# EAGLE design DAB+ FM Radio (EAGLE 7.6.0)
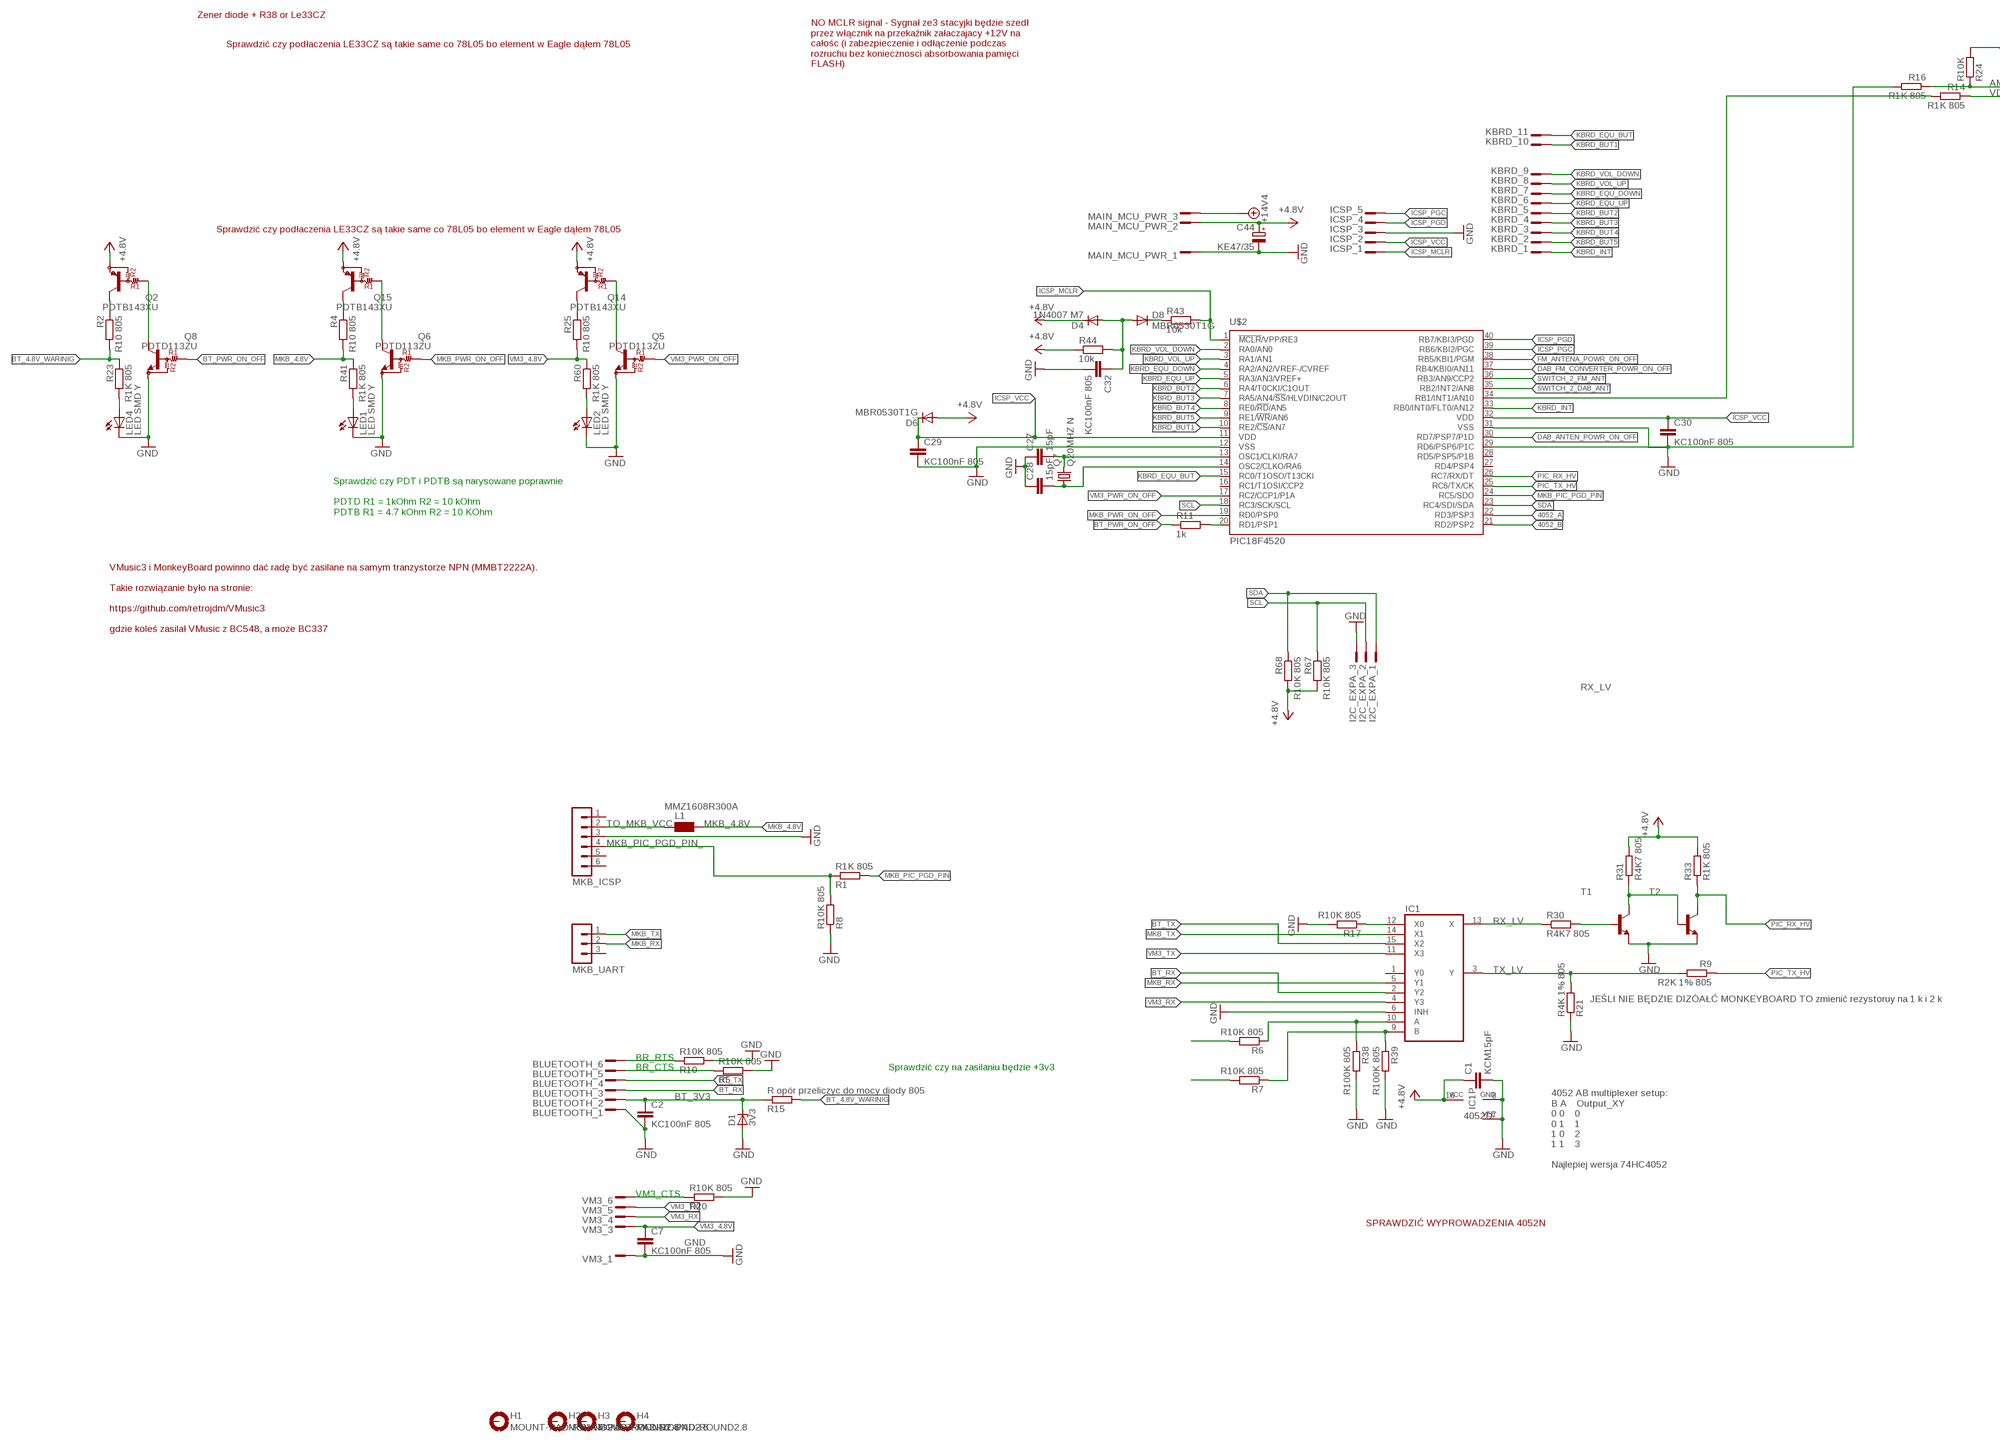
[diagram p0: schematic, sheet 1, part 1 of 2]
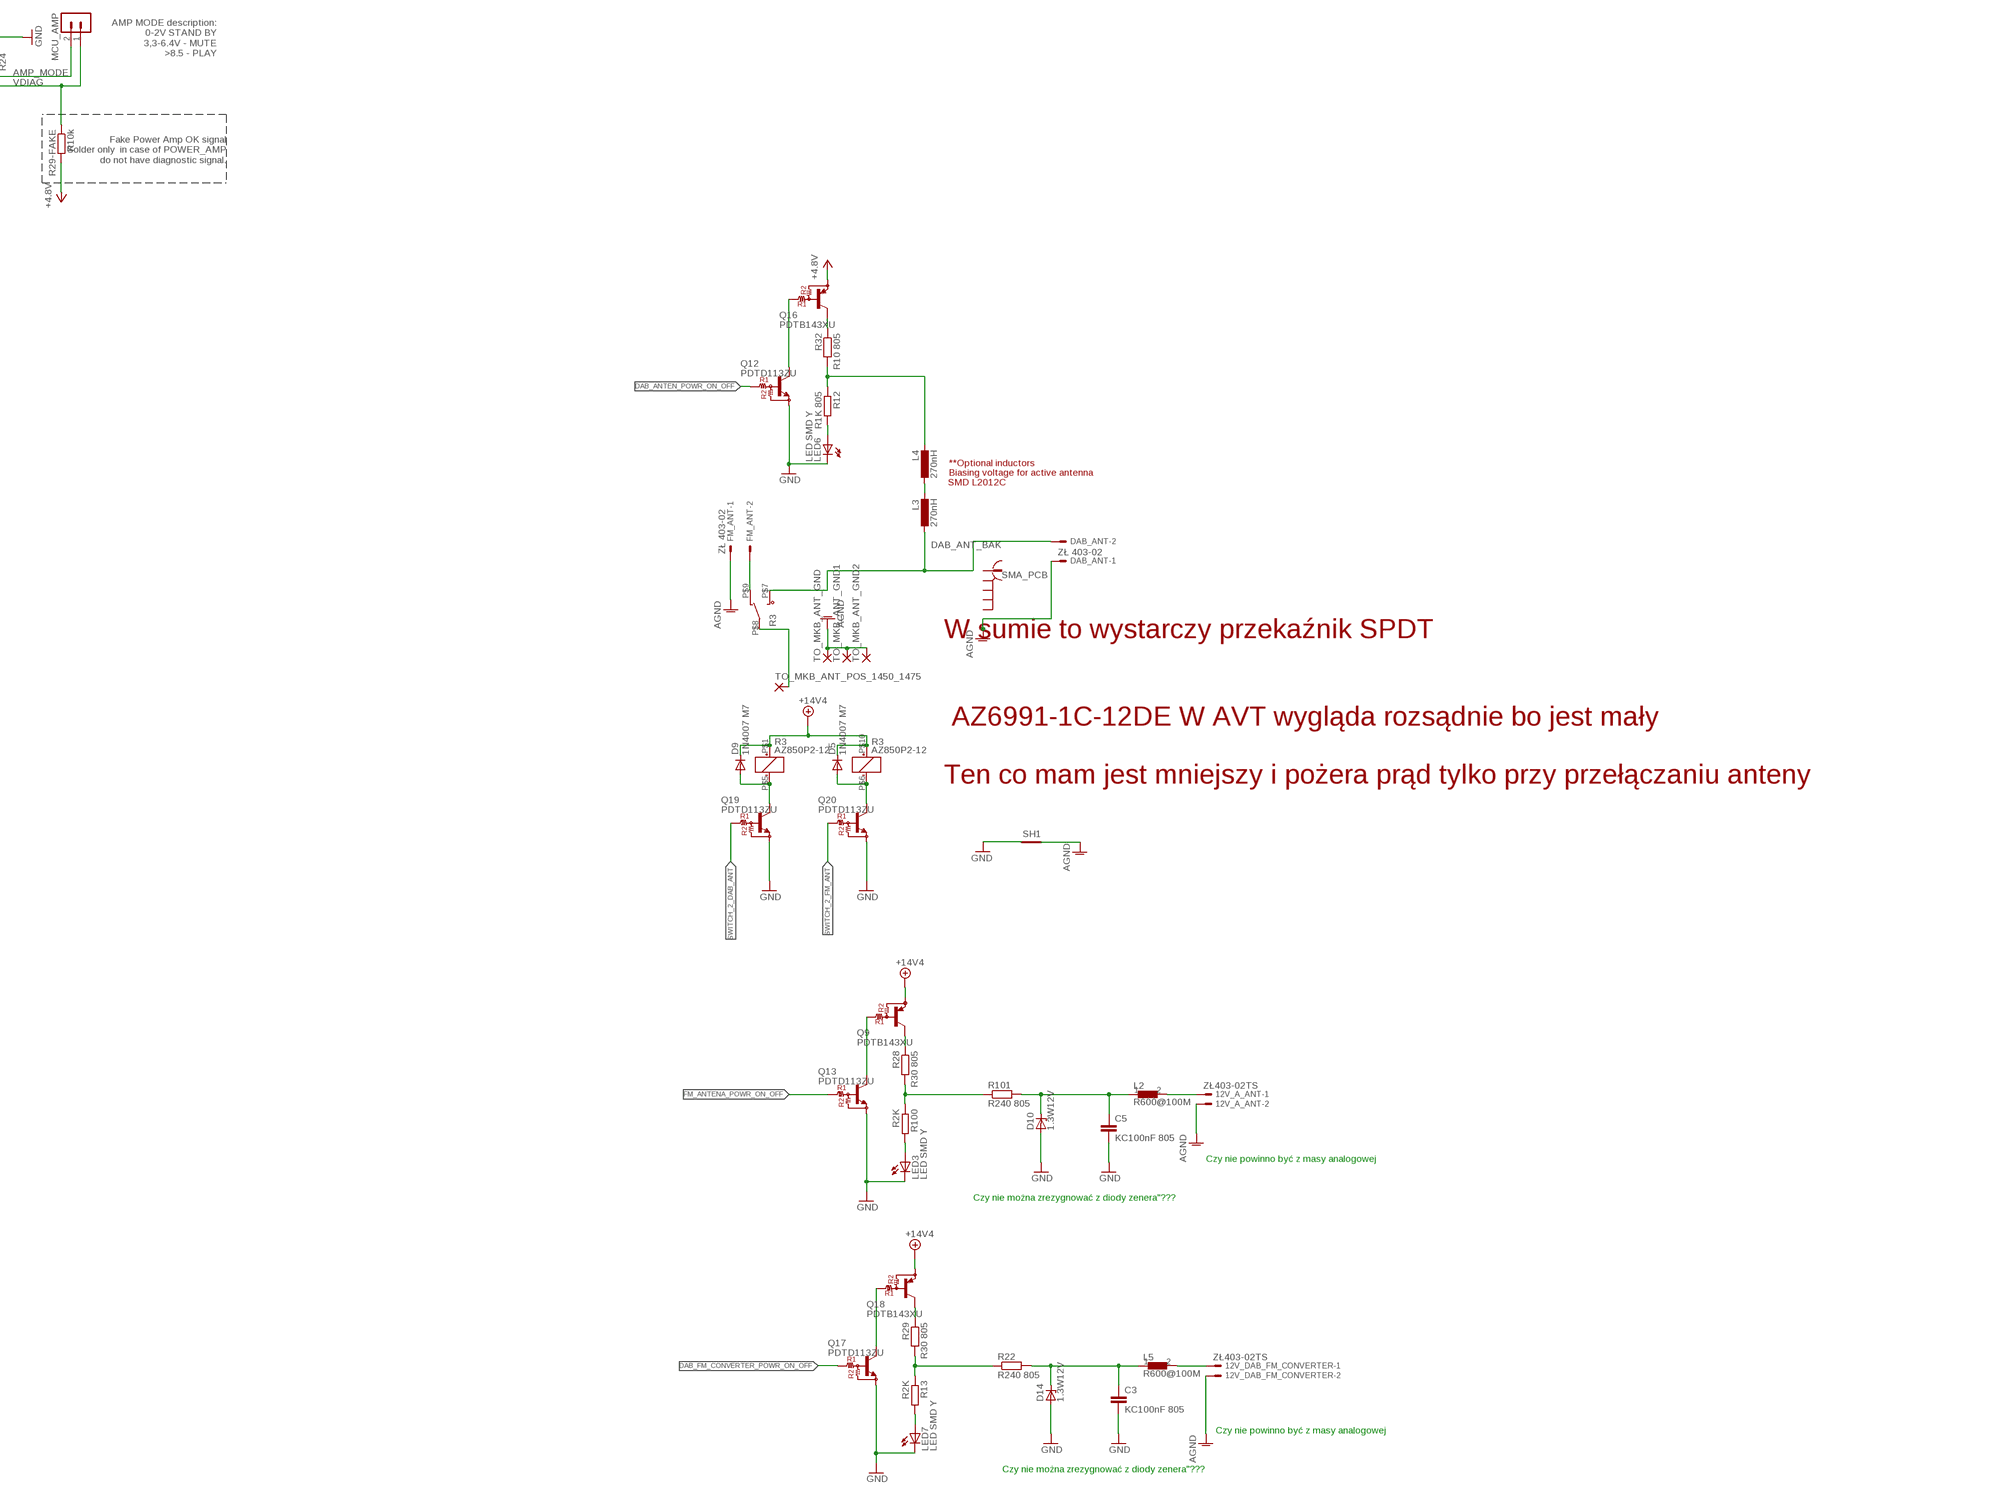
[diagram p1: schematic, sheet 1, part 2 of 2]

## Parts
12V_A_ANT  ZŁ403-02TS  22-23-2021  [22-23-2021]
12V_DAB_FM_CONVERTER  ZŁ403-02TS  22-23-2021  [22-23-2021]
BLUETOOTH  JST_6_PIN_B6B-PH-KS  [B6B-PH-KS]
C1  KCM15pF  C-EUC0805  [C0805]
C2  KC100nF 805  C-EUC0805  [C0805]
C3  KC100nF 805  C-EUC0805  [C0805]
C5  KC100nF 805  C-EUC0805  [C0805]
C7  KC100nF 805  C-EUC0805  [C0805]
C27  15pF  C-EUC0805  [C0805]
C28  15pF  C-EUC0805  [C0805]
C29  KC100nF 805  C-EUC0805  [C0805]
C30  KC100nF 805  C-EUC0805  [C0805]
C32  KC100nF 805  C-EUC0805  [C0805]
C44  KE47/35  CPOL-EUTT2D6  [TT2D6]
D1  3V3  ZENER-DIODESOD80C  [SOD80C]
D4  1N4007 M7  CGRM4001-G  [SOD-123_MINI-SMA]
D5  1N4007 M7  CGRM4001-G  [SOD-123_MINI-SMA]
D6  MBR0530T1G  MBR0520LT  [SOD123]
D8  MBR0530T1G  MBR0520LT  [SOD123]
D9  1N4007 M7  CGRM4001-G  [SOD-123_MINI-SMA]
D10  1.3W12V  ZENER-DIODEZD-2.5  [ZDIO-2.5]
D14  1.3W12V  ZENER-DIODEZD-2.5  [ZDIO-2.5]
DAB_ANT  ZŁ 403-02  22-27-2021-02  [6410-02]
DAB_ANT_BAK  SMA_PCB  [SMA_PCB]
FM_ANT  ZŁ 403-02  22-27-2021-02  [6410-02]
H1  MOUNT-PAD-ROUND2.8  [2,8-PAD]
H2  MOUNT-PAD-ROUND2.8  [2,8-PAD]
H3  MOUNT-PAD-ROUND2.8  [2,8-PAD]
H4  MOUNT-PAD-ROUND2.8  [2,8-PAD]
I2C_EXPA  JST_3_PIN_B3B-PH-KS  [B3B-PH-KS]
IC1  4052D  [SO16]
ICSP  JST_5_PIN_B5B-PH-KS  [B5B-PH-KS]
KBRD  JST_11_PIN_B11B-PH-KS  [B11B-PH-KS]
L1  MMZ1608R300A  WE-CBF_0603  [0603]
L2  R600@100M  FERRITR0805  [R0805]
L3  270nH  L-EUL2012C  [L2012C]
L4  270nH  L-EUL2012C  [L2012C]
L5  R600@100M  FERRITR0805  [R0805]
LED1  LED SMD Y  LEDCHIP-LED0805  [CHIP-LED0805]
LED2  LED SMD Y  LEDCHIP-LED0805  [CHIP-LED0805]
LED3  LED SMD Y  LED  [SMARTLED-TTW]
LED4  LED SMD Y  LEDCHIP-LED0805  [CHIP-LED0805]
LED6  LED SMD Y  LED  [SMARTLED-TTW]
LED7  LED SMD Y  LED  [SMARTLED-TTW]
MAIN_MCU_PWR  JST_3_PIN_B3B-XH-A  [B3B-XH-A]
MCU_AMP  MA02-1  [MA02-1]
MKB_ICSP  MA06-1  [MA06-1]
MKB_UART  MA03-1  [MA03-1]
Q2  PDTB143XU  [SOT-23]
Q5  PDTD113ZU  [SOT-23]
Q6  PDTD113ZU  [SOT-23]
Q7  Q20MHZ N  CRYSTALHC49S  [HC49/S]
Q8  PDTD113ZU  [SOT-23]
Q9  PDTB143XU  [SOT-23]
Q12  PDTD113ZU  [SOT-23]
Q13  PDTD113ZU  [SOT-23]
Q14  PDTB143XU  [SOT-23]
Q15  PDTB143XU  [SOT-23]
Q16  PDTB143XU  [SOT-23]
Q17  PDTD113ZU  [SOT-23]
Q18  PDTB143XU  [SOT-23]
Q19  PDTD113ZU  [SOT-23]
Q20  PDTD113ZU  [SOT-23]
R1  R1K 805  R-EU_R0805  [R0805]
R2  R10 805  R-EU_R0805  [R0805]
R3  AZ850P2-12  [AZ850-2C]
R4  R10 805  R-EU_R0805  [R0805]
R5  R10K 805  R-EU_R0805  [R0805]
R6  R10K 805  R-EU_R0805  [R0805]
R7  R10K 805  R-EU_R0805  [R0805]
R8  R10K 805  R-EU_R0805  [R0805]
R9  R2K 1% 805  R-EU_R0805  [R0805]
R10  R10K 805  R-EU_R0805  [R0805]
R11  1k  R-EU_R0805  [R0805]
R12  R1K 805  R-EU_R0805  [R0805]
R13  R2K  R-EU_R0805  [R0805]
R14  R1K 805  R-EU_R0805  [R0805]
R15  R opór przeliczyc do mocy diody 805  R-EU_R0805  [R0805]
R16  R1K 805  R-EU_R0805  [R0805]
R17  R10K 805  R-EU_R0805  [R0805]
R20  R10K 805  R-EU_R0805  [R0805]
R21  R4K 1% 805  R-EU_R0805  [R0805]
R22  R240 805  R-EU_M0805  [M0805]
R23  R1K 805  R-EU_R0805  [R0805]
R24  R10K  R-EU_R0805  [R0805]
R25  R10 805  R-EU_R0805  [R0805]
R28  R30 805  R-EU_R0805  [R0805]
R29  R30 805  R-EU_R0805  [R0805]
R29-FAKE  R10k  R-EU_M0805  [M0805]
R30  R4K7 805  R-EU_R0805  [R0805]
R31  R4K7 805  R-EU_R0805  [R0805]
R32  R10 805  R-EU_R0805  [R0805]
R33  R1K 805  R-EU_R0805  [R0805]
R38  R100K 805  R-EU_M0805  [M0805]
R39  R100K 805  R-EU_M0805  [M0805]
R41  R1K 805  R-EU_R0805  [R0805]
R43  10k  R-EU_R0805  [R0805]
R44  10k  R-EU_M0805  [M0805]
R60  R1K 805  R-EU_R0805  [R0805]
R67  R10K 805  R-EU_R0805  [R0805]
R68  R10K 805  R-EU_R0805  [R0805]
R100  R2K  R-EU_R0805  [R0805]
R101  R240 805  R-EU_M0805  [M0805]
SH1  SHORT-HT5  [SHORT_TOP-50]
T1  MMBT2222ALT1-NPN-SOT23-BEC  [SOT23-BEC]
T2  MMBT2222ALT1-NPN-SOT23-BEC  [SOT23-BEC]
TO_MKB_ANT_GND  2,54/0,8  [2,54/0,8]
TO_MKB_ANT_GND1  2,54/0,8  [2,54/0,8]
TO_MKB_ANT_GND2  2,54/0,8  [2,54/0,8]
TO_MKB_ANT_POS_1450_1475  2,54/0,8  [2,54/0,8]
U$2  PIC18F4520  [DIL40]
VM3  JST_6_PIN_B6B-PH-KS  [B6B-PH-KS]

## Nets
4052_A: R6.2 U$2.22(RD3/PSP3)
4052_B: R7.2 U$2.21(RD2/PSP2)
+5V: C1.1 C44.+ D4.C D6.A IC1.16(VCC) MAIN_MCU_PWR.P$2 Q2.2(E) Q14.2(E) Q15.2(E) Q16.2(E) R29-FAKE.2 R31.2 R33.2 R44.1 R67.2 R68.2 ; supply symbol labelled +4.8V
+14V4: D5.C D9.C MAIN_MCU_PWR.P$3 Q9.2(E) Q18.2(E) R3.P$1(S$1:+) R3.P$10(R$2:+)
AGND: 12V_A_ANT.2 12V_DAB_FM_CONVERTER.2 DAB_ANT.1 FM_ANT.1 SH1.2 TO_MKB_ANT_GND1.1(P) TO_MKB_ANT_GND2.1(P) TO_MKB_ANT_GND.1(P)
AMP_MODE: MCU_AMP.2 R16.1 R24.1
BT_3V3: BLUETOOTH.P$2 C2.1 D1.C R15.1
BT_4.8V_WARINIG: R2.2 R15.2 R23.1
BT_PWR_ON_OFF: Q8.1(B) R11.1
BT_RX: BLUETOOTH.P$3 IC1.2(Y2)
BT_TX: BLUETOOTH.P$4 IC1.15(X2)
DAB_ANTEN_POWR_ON_OFF: Q12.1(B) U$2.30(RD7/PSP7/P1D)
DAB_FM_CONVERTER_POWR_ON_OFF: Q17.1(B) U$2.37(RB4/KBI0/AN11)
FM_ANTENA_POWR_ON_OFF: Q13.1(B) U$2.38(RB5/KBI1/PGM)
GND: BLUETOOTH.P$1 C1.2 C2.2 C3.2 C5.2 C7.2 C27.1 C28.1 C29.2 C30.2 C32.2 C44.- D1.A D10.A D14.A I2C_EXPA.P$3 IC1.6(INH) IC1.7(VEE) IC1.8(GND) ICSP.P$3 LED1.C LED2.C LED3.C@1(C) LED4.C LED6.C@1(C) LED7.C@1(C) MAIN_MCU_PWR.P$1 MKB_ICSP.3 Q5.2(E) Q6.2(E) Q8.2(E) Q12.2(E) Q13.2(E) Q17.2(E) Q19.2(E) Q20.2(E) R5.2 R8.1 R10.2 R17.2 R20.2 R21.1 R24.2 R38.2 R39.2 SH1.1 T1.E T2.E U$2.12(VSS) U$2.31(VSS) VM3.P$1
ICSP_MCLR: ICSP.P$1 R43.2 U$2.1(!MCLR!/VPP/RE3)
ICSP_PGC: ICSP.P$5 U$2.39(RB6/KBI2/PGC)
ICSP_PGD: ICSP.P$4 U$2.40(RB7/KBI3/PGD)
ICSP_VCC: C29.1 C30.1 D6.C ICSP.P$2 U$2.11(VDD) U$2.32(VDD)
KBRD_BUT1: KBRD.P$10 U$2.10(RE2/!CS!/AN7)
KBRD_BUT2: KBRD.P$5 U$2.6(RA4/T0CKI/C1OUT)
KBRD_BUT3: KBRD.P$4 U$2.7(RA5/AN4/!SS!/HLVDIN/C2OUT)
KBRD_BUT4: KBRD.P$3 U$2.8(RE0/!RD!/AN5)
KBRD_BUT5: KBRD.P$2 U$2.9(RE1/!WR!/AN6)
KBRD_EQU_BUT: KBRD.P$11 U$2.15(RC0/T1OSO/T13CKI)
KBRD_EQU_DOWN: KBRD.P$7 U$2.4(RA2/AN2/VREF-/CVREF)
KBRD_EQU_UP: KBRD.P$6 U$2.5(RA3/AN3/VREF+)
KBRD_INT: KBRD.P$1 U$2.33(RB0/INT0/FLT0/AN12)
KBRD_VOL_DOWN: KBRD.P$9 U$2.2(RA0/AN0)
KBRD_VOL_UP: KBRD.P$8 U$2.3(RA1/AN1)
MKB_4.8V: L1.2 R4.2 R41.1
MKB_PIC_PGD_PIN: R1.2 U$2.24(RC5/SDO)
MKB_PIC_PGD_PIN_: MKB_ICSP.4 R1.1 R8.2
MKB_PWR_ON_OFF: Q6.1(B) U$2.19(RD0/PSP0)
MKB_RX: IC1.5(Y1) MKB_UART.2
MKB_TX: IC1.14(X1) MKB_UART.1
N$1: L4.1 R12.1 R32.2
N$2: D9.A Q19.3(C) R3.P$5(S$1:-)
N$3: R3.P$8 TO_MKB_ANT_POS_1450_1475.1(P)
N$4: DAB_ANT.2 L3.2 R3.P$7
N$5: FM_ANT.2 R3.P$9
N$6: D5.A Q20.3(C) R3.P$6(R$2:-)
N$7: Q2.3(C) R2.1
N$8: R16.2 U$2.29(RD6/PSP6/P1C)
N$9: IC1.12(X0) R17.1
N$10: R14.2 U$2.34(RB1/INT1/AN10)
N$11: R30.2 T1.B
N$12: L3.1 L4.2
N$13: IC1.9(B) R7.1 R39.1
N$14: R31.1 T1.C T2.B
N$15: C27.2 Q7.2 U$2.13(OSC1/CLKI/RA7)
N$16: C28.2 Q7.1 U$2.14(OSC2/CLKO/RA6)
N$17: R11.2 U$2.20(RD1/PSP1)
N$18: Q15.3(C) R4.1
N$19: Q2.1(B) Q8.3(C)
N$20: Q12.3(C) Q16.1(B)
N$21: LED4.A R23.2
N$23: LED6.A@1(A) R12.2
N$25: Q17.3(C) Q18.1(B)
N$26: R13.1 R22.1 R29.2
N$27: LED7.A@1(A) R13.2
N$28: Q5.3(C) Q14.1(B)
N$29: C3.1 D14.C L5.1 R22.2
N$30: 12V_DAB_FM_CONVERTER.1 L5.2
N$31: LED2.A R60.2
N$32: Q14.3(C) R25.1
N$33: Q16.3(C) R32.1
N$34: Q9.3(C) R28.1
N$35: Q18.3(C) R29.1
N$37: Q6.3(C) Q15.1(B)
N$38: BLUETOOTH.P$5 R5.1
N$39: LED1.A R41.2
N$41: D8.C R43.1
N$42: C32.1 D4.A D8.A R44.2
N$43: BLUETOOTH.P$6 R10.1
N$44: R20.1 VM3.P$6
N$47: IC1.10(A) R6.1 R38.1
N$85: Q9.1(B) Q13.3(C)
N$87: R28.2 R100.1 R101.1
N$88: LED3.A@1(A) R100.2
N$91: C5.1 D10.C L2.1 R101.2
N$92: 12V_A_ANT.1 L2.2
PIC_RX_HV: R33.1 T2.C U$2.26(RC7/RX/DT)
PIC_TX_HV: R9.1 U$2.25(RC6/TX/CK)
RX_LV: IC1.13(X) R30.1
SCL: I2C_EXPA.P$2 R67.1 U$2.18(RC3/SCK/SCL)
SDA: I2C_EXPA.P$1 R68.1 U$2.23(RC4/SDI/SDA)
SWITCH_2_DAB_ANT: Q19.1(B) U$2.35(RB2/INT2/AN8)
SWITCH_2_FM_ANT: Q20.1(B) U$2.36(RB3/AN9/CCP2)
TO_MKB_VCC: L1.1 MKB_ICSP.2
TX_LV: IC1.3(Y) R9.2 R21.2
VDIAG: MCU_AMP.1 R14.1 R29-FAKE.1
VM3_4.8V: C7.1 R25.2 R60.1 VM3.P$3
VM3_PWR_ON_OFF: Q5.1(B) U$2.17(RC2/CCP1/P1A)
VM3_RX: IC1.4(Y3) VM3.P$4
VM3_TX: IC1.11(X3) VM3.P$5
Unconnected: DAB_ANT_BAK.P$1 H1.B2,8(MOUNT) H2.B2,8(MOUNT) H3.B2,8(MOUNT) H4.B2,8(MOUNT) IC1.1(Y0) MKB_ICSP.1 MKB_ICSP.5 MKB_ICSP.6 MKB_UART.3 R3.P$2 R3.P$3 R3.P$4 U$2.16(RC1/T1OSI/CCP2) U$2.27(RD4/PSP4) U$2.28(RD5/PSP5/P1B) VM3.P$2

## Notes on the sheet
- Zener diode + R38 or Le33CZ
- Sprawdzić czy podłaczenia LE33CZ są takie same co 78L05 bo element w Eagle dąłem 78L05
- NO MCLR signal - Sygnał ze3 stacyjki będzie szedł
  przez włącznik na przekaźnik załaczajacy +12V na
  całośc (i zabezpieczenie i odłączenie podczas
  rozruchu bez koniecznosci absorbowania pamięci
  FLASH)
- AMP MODE description:
  0-2V STAND BY
  3,3-6.4V - MUTE
  >8.5 - PLAY
- Fake Power Amp OK signal
  Solder only  in case of POWER_AMP
  do not have diagnostic signal.
- Sprawdzić czy podłaczenia LE33CZ są takie same co 78L05 bo element w Eagle dąłem 78L05
- **Optional inductors
- Biasing voltage for active antenna
- SMD L2012C
- Sprawdzić czy PDT i PDTB są narysowane poprawnie
  
  PDTD R1 = 1kOhm R2 = 10 kOhm
  PDTB R1 = 4.7 kOhm R2 = 10 KOhm
- VMusic3 i MonkeyBoard powinno dać radę być zasilane na samym tranzystorze NPN (MMBT2222A).
  
  Takie rozwiązanie było na stronie:
  
  https://github.com/retrojdm/VMusic3
  
  gdzie koleś zasilał VMusic z BC548, a może BC337
- W sumie to wystarczy przekaźnik SPDT
  
  
   AZ6991-1C-12DE W AVT wygląda rozsądnie bo jest mały
  
  Ten co mam jest mniejszy i pożera prąd tylko przy przełączaniu anteny
- JEŚLI NIE BĘDZIE DIZÓAŁĆ MONKEYBOARD TO zmienić rezystoruy na 1 k i 2 k
- BR_RTS
- BR_CTS | Sprawdzić czy na zasilaniu będzie +3v3
- 4052 AB multiplexer setup:
  B A    Output_XY
  0 0    0
  0 1    1
  1 0    2
  1 1    3
  
  Najlepiej wersja 74HC4052
- Czy nie powinno być z masy analogowej
- VM3_CTS
- Czy nie można zrezygnować z diody zenera"???
- SPRAWDZIĆ WYPROWADZENIA 4052N
- Czy nie powinno być z masy analogowej
- Czy nie można zrezygnować z diody zenera"???

## Power pins joined to a net without a drawn wire
GND: DAB_ANT_BAK.GND@1(GND) DAB_ANT_BAK.GND@2(GND) DAB_ANT_BAK.GND@3(GND) DAB_ANT_BAK.GND@4(GND)

## Library data of the parts
12V_A_ANT 12V_DAB_FM_CONVERTER = con-molex:22-23-2021: .100" (2.54mm) Center Header - 2 Pin; MF: MOLEX; MPN: 22-23-2021; OC_FARNELL: 1462926; OC_NEWARK: 25C3832
BLUETOOTH VM3 = conn-JST:JST_6_PIN_
C1-C3 C5 C7 C27-C30 C32 = rcl:C-EU: CAPACITOR, European symbol
C44 = rcl:CPOL-EU: POLARIZED CAPACITOR, European symbol
D1 D10 D14 = diode:ZENER-DIODE: Z-Diode
D4 D5 D9 = diode:CGRM400*-G: Molded plasitc,JEDEC SOD-123/Mini SMA Source: Comchip CGRM4001-G.pdf
D6 D8 = diode:MBR0520LT: SCHOTTKY BARRIER RECTIFIER Source: http://onsemi.com .. MBR0520LT1-D.pdf
DAB_ANT FM_ANT = con-molex:22-?-02: CONNECTOR wire to board 2.54 mm (.1 inch) pitch header; OC_FARNELL: unknown; OC_NEWARK: unknown
DAB_ANT_BAK = Monkey:SMA_PCB: TE CONNECTIVITY - 5-1814832-1 - SOCKET, SMA, STRAIGHT PCB,50OHM Manufacturer: TE CONNECTIVITY Order Code: 1248990 Manufacturer Part No: 5-1814832-1 http://www.farnell.com/datasheets/316178.pdf
H1-H4 = holes:MOUNT-PAD-ROUND: MOUNTING PAD, round
I2C_EXPA MAIN_MCU_PWR = conn-JST:JST_3_PIN_
IC1 = 40xx:4052: Dual 4-channel ANALOG MULTIPLEXER
ICSP = conn-JST:JST_5_PIN_
KBRD = conn-JST:JST_11_PIN_
L1 = wuerth-elektronik:WE-CBF: SMD EMI Suppression Ferrite Beads - excellent anti-EMI properties - low DCR - impedances till 3000 ohms - rated current up to 6 A
L2 L5 = ferrit_bear:FERRIT
L3 L4 = resistor:L-EU: INDUCTOR, European symbol
LED1-LED4 LED6 LED7 = adafruit:LED: LED OSRAM: - CHIPLED LG R971, LG N971, LY N971, LG Q971, LY Q971, LO R971, LY R971 LH N974, LH R974 LS Q976, LO Q976, LY Q976 LO Q996 - Hyper CHIPLED LW Q18S LB Q993, LB Q99A, LB R99A - SideLED LS A670, LO A670, LY A670, LG A670, LP A670 LB A673, LV A673, LT A673, LW A673 LH A674 LY A675 LS A676, LA A676, LO A676, LY A676, LW A676 LS A679, LY A679, LG A679 - Hyper Micro SIDELED® LS Y876, LA Y876, LO Y876, LY Y876 LT Y87S - SmartLED LW L88C, LW L88S LB L89C, LB L89S, LG L890 LS L89K, LO L89K, LY L89K LS L896, LA L896, LO L896, LY L896 - TOPLED LS T670, LO T670, LY T670, LG T670, LP T670 LSG T670, LSP T670, LSY T670, LOP T670, LYG T670 LG T671, LOG T671, LSG T671 LB T673, LV T673, LT T673, LW T673 LH T674 LS T676, LA T676, LO T676, LY T676, LB T676, LH T676, LSB T676, LW T676 LB T67C, LV T67C, LT T67C, LS T67K, LO T67K, LY T67K, LW E67C LS E67B, LA E67B, LO E67B, LY E67B, LB E67C, LV E67C, LT E67C LW T67C LS T679, LY T679, LG T679 LS T770, LO T770, LY T770, LG T770, LP T770 LB T773, LV T773, LT T773, LW T773 LH T774 LS E675, LA E675, LY E675, LS T675 LS T776, LA T776, LO T776, LY T776, LB T776 LHGB T686 LT T68C, LB T68C - Hyper Mini TOPLED® LB M676 - Mini TOPLED Santana® LG M470 LS M47K, LO M47K, LY M47K Source: http://www.osram.convergy.de/
MCU_AMP = con-lstb_SileliS:MA02-1: PIN HEADER
MKB_ICSP = con-lstb:MA06-1: PIN HEADER; OC_FARNELL: unknown; OC_NEWARK: unknown
MKB_UART = con-lstb:MA03-1: PIN HEADER; OC_FARNELL: unknown; OC_NEWARK: unknown
Q2 Q9 Q14-Q16 Q18 = pre-bias-transistor:PDTB: PNP Resistor-Equipped Transistor (RET) family in a very small SOT323 (SC-70) Surface-Mounted Device (SMD) plastic package. VCC = -50 IC (max) = -500mA; R1: 4.7 kOhm; R2: 10 kOhm
Q5 Q6 Q8 Q12 Q13 Q17 Q19 Q20 = pre-bias-transistor:PDTD: Pre biase NPN transistor NPN Resistor-Equipped Transistor (RET) family in a very small SOT323 (SC-70) Surface-Mounted Device (SMD) plastic package. VCC = 50V Ic (max) = 500 mA; R1: 1 kOhm; R2: 10 kOhm
Q7 = adafruit:CRYSTAL: CRYSTAL; OC_FARNELL: 1667008; OC_NEWARK: unknown
R1 R2 R4-R17 R20-R25 R28 R29 R29-FAKE R30-R33 R38 R39 R41 R43 R44 R60 R67 R68 R100 R101 = rcl:R-EU_: RESISTOR, European symbol
R3 = relay_silelis:AZ850P2-12
SH1 = shorts-old:SHORT-H: Short between two nets; BOM: no
T1 T2 = transistor-neu-to92:*-NPN-: NPN Transistror
TO_MKB_ANT_GND TO_MKB_ANT_GND1 TO_MKB_ANT_GND2 TO_MKB_ANT_POS_1450_1475 = wirepad:2,54/0,8: THROUGH-HOLE PAD
U$2 = microchip_SileliS:PIC18F4*20

## Net classes
1 VCC: width 0.6 mm, clearance 0.6 mm

## Board
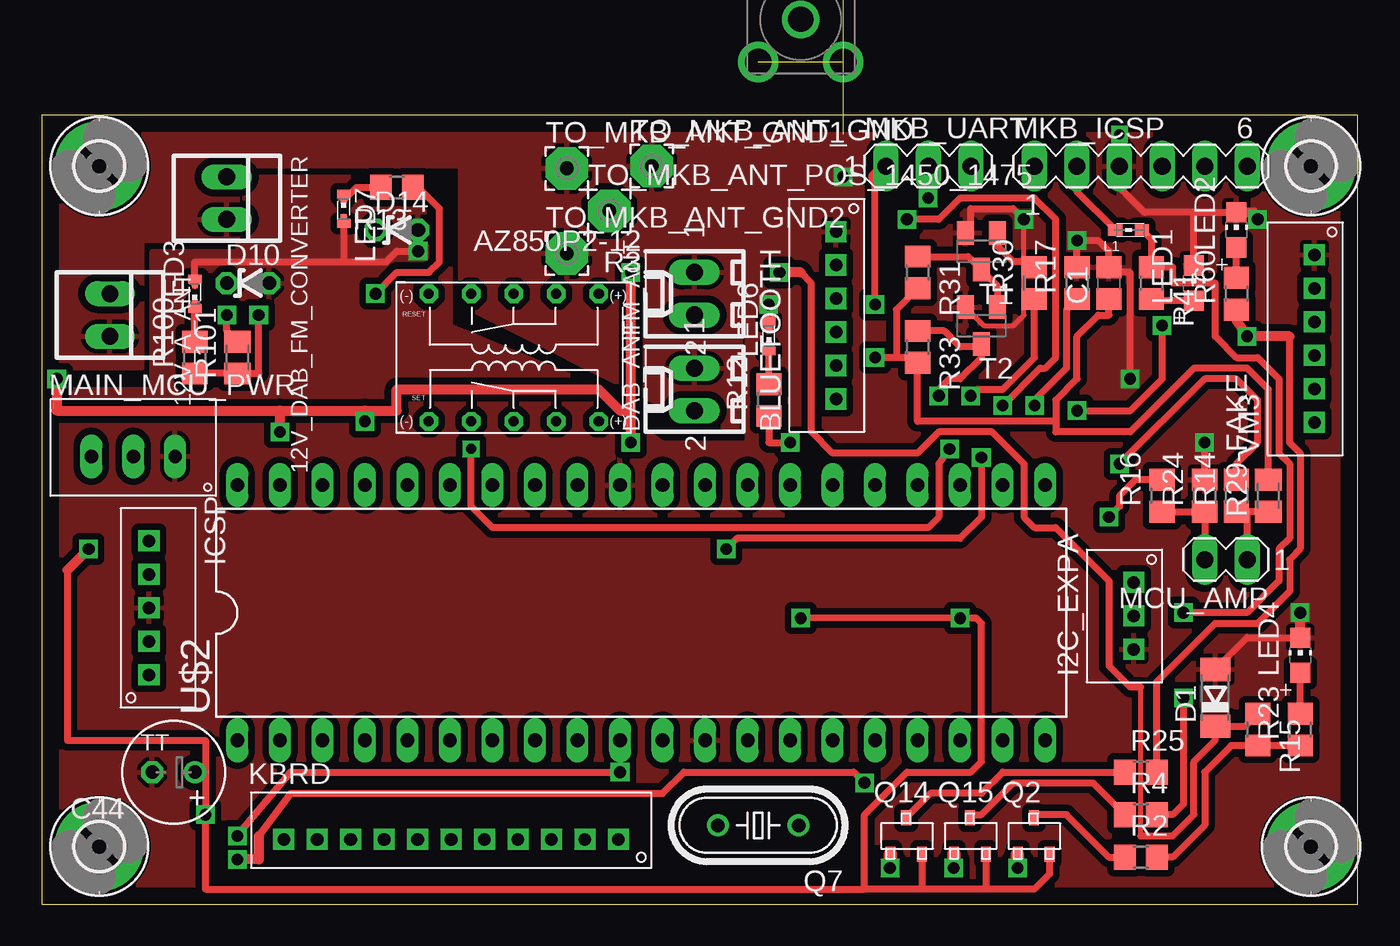
[diagram p2: board, top side]
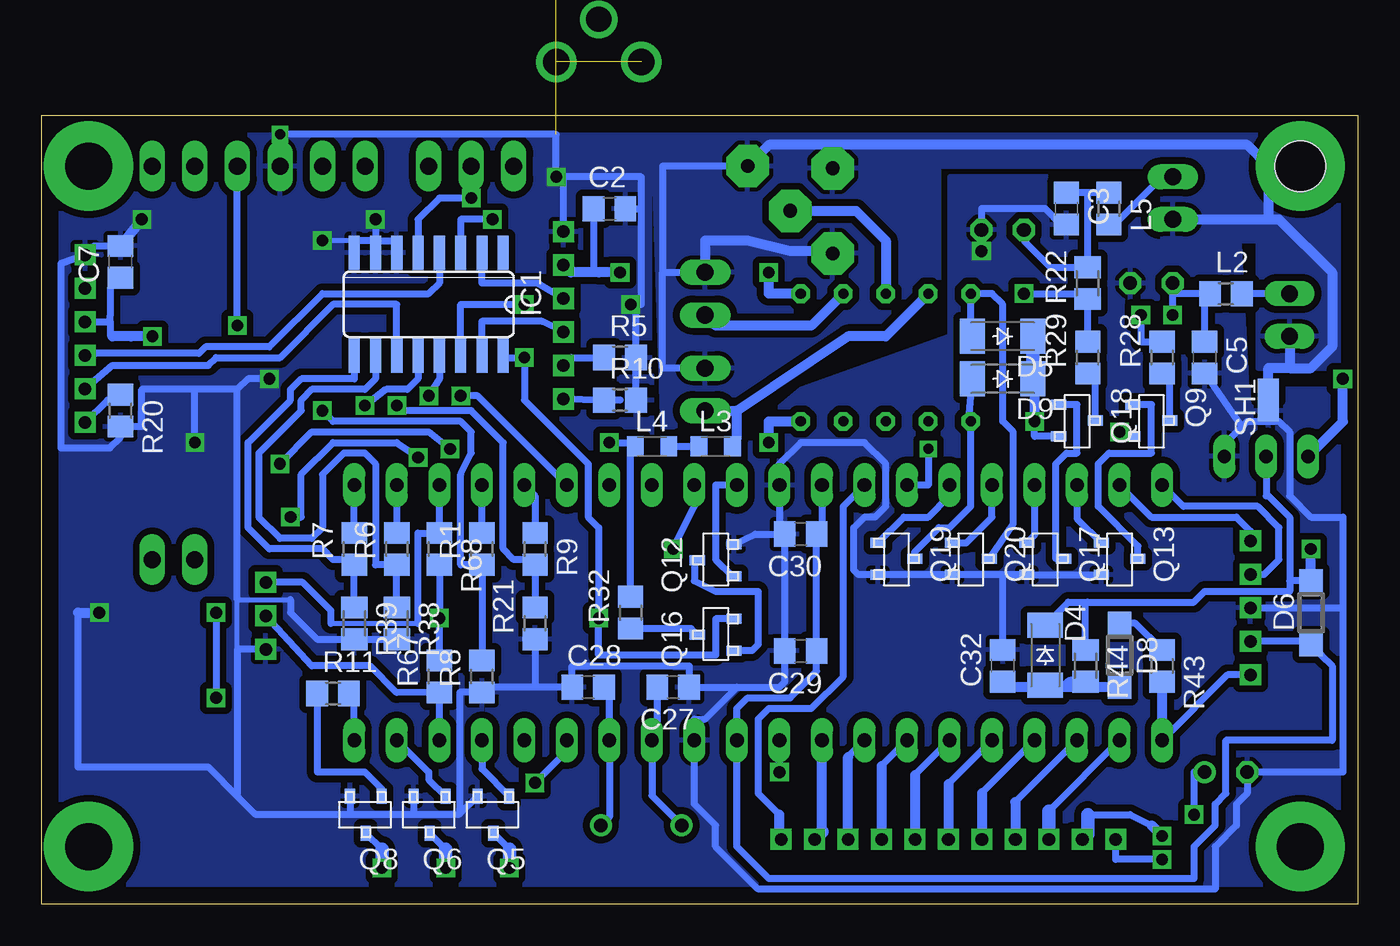
[diagram p3: board, bottom side, seen from below]

Size 78.61 x 47.12 mm. Coordinates in mm from the lower left corner, seen from the top.
Outline: 0,0 78.61,0 78.61,47.12 0,47.12 0,0
Copper layers (1*16): Top 0.035mm / dielectric 1.5mm / Bottom 0.035mm
Design rules "default": minimum track width 10mil, minimum drill 24mil, track to track 8mil, track to pad 8mil, pad to pad 8mil, via to via 8mil, smd to smd 8mil, copper to edge 40mil, drill to drill 8mil, minimum pad ring 10mil, minimum via ring 8mil, stop-mask expansion 4mil, vias tented up to drill 0mil, thermal gap 10mil
Holes 3 mm at 3.43,44.07

### Footprints (pad centres in the part's own frame; a part is rotated, then mirrored left to right if it is on the bottom)
22-23-2021 = drill 1 long: 1 -1.27,0; 2 1.27,0
B6B-PH-KS = drill 0.75 pad 1.2 square: P$1 -2,1.7; P$2 -4,1.7; P$3 -6,1.7; P$4 -8,1.7; P$5 -10,1.7; P$6 -12,1.7
C0805 = smd 1.3 x 1.5: 1 -0.95,0; 2 0.95,0
TT2D6 = drill 0.813: + -1.27,0 | drill 0.813 octagon: - 1.27,0
SOD80C = smd 1.4 x 1.8: A 1.7,0; C -1.7,0
SOD-123_MINI-SMA = smd 1.5 x 2.1: A 1.8,0; C -1.8,0
SOD123 = smd 1.4 x 1.4: A 1.9,0; C -1.9,0
ZDIO-2.5 = drill 0.813 octagon: A 1.27,0; C -1.27,0
6410-02 = drill 1.016 long: 1 1.27,0; 2 -1.27,0
SMA_PCB = drill 1.6: GND@1 -2.54,2.54; GND@2 2.54,2.54; GND@3 -2.54,-2.54; GND@4 2.54,-2.54 | drill 1.5: P$1 0,0
2,8-PAD = drill 2.8 pad 5.334: B2,8 0,0
B3B-PH-KS = drill 0.75 pad 1.2 square: P$1 -2,1.7; P$2 -4,1.7; P$3 -6,1.7
SO16 = smd 0.66 x 2.032: 1 -4.445,-3.073; 2 -3.175,-3.073; 3 -1.905,-3.073; 4 -0.635,-3.073; 5 0.635,-3.073; 6 1.905,-3.073; 7 3.175,-3.073; 8 4.445,-3.073; 9 4.445,3.073; 10 3.175,3.073; 11 1.905,3.073; 12 0.635,3.073; 13 -0.635,3.073; 14 -1.905,3.073; 15 -3.175,3.073; 16 -4.445,3.073
B5B-PH-KS = drill 0.75 pad 1.2 square: P$1 -2,1.7; P$2 -4,1.7; P$3 -6,1.7; P$4 -8,1.7; P$5 -10,1.7
B11B-PH-KS = drill 0.75 pad 1.2 square: P$1 -2,1.7; P$2 -4,1.7; P$3 -6,1.7; P$4 -8,1.7; P$5 -10,1.7; P$6 -12,1.7; P$7 -14,1.7; P$8 -16,1.7; P$9 -18,1.7; P$10 -20,1.7; P$11 -22,1.7
0603 = smd 0.85 x 0.7: 1 -0.9,0; 2 0.7,0
R0805 = smd 1.3 x 1.5: 1 -0.95,0; 2 0.95,0
L2012C = smd 1 x 1.2: 1 -1,0; 2 1,0
CHIP-LED0805 = smd 1.2 x 1.2: A 0,-1.05; C 0,1.05
SMARTLED-TTW = smd 0.8 x 0.5: A 0,-0.875; C 0,0.875 | smd 0.35 x 0.35: A@1 0,-0.5; C@1 0,0.5
B3B-XH-A = drill 0.8 long: P$1 -2.45,2.35; P$2 -4.95,2.35; P$3 -7.45,2.35
MA02-1 = drill 1.016 long: 1 -2.54,0; 2 0,0
MA06-1 = drill 1.016 long: 1 -6.35,0; 2 -3.81,0; 3 -1.27,0; 4 1.27,0; 5 3.81,0; 6 6.35,0
MA03-1 = drill 1.016 long: 1 -2.54,0; 2 0,0; 3 2.54,0
SOT-23 = smd 0.6 x 0.9: 1 -1,-1.1; 2 0.9,-1.1; 3 -0.05,1.1
HC49/S = drill 0.813: 1 -2.413,0; 2 2.413,0
AZ850-2C = drill 0.6 octagon: P$1 -5.08,3.81; P$2 -2.54,3.81; P$3 0,3.81; P$4 2.54,3.81; P$5 5.08,3.81; P$6 5.08,-3.81; P$7 2.54,-3.81; P$8 0,-3.81; P$9 -2.54,-3.81; P$10 -5.08,-3.81
M0805 = smd 1.3 x 1.6: 1 -0.95,0; 2 0.95,0
SHORT_TOP-50 = smd 1.27 x 1.27: 1 0.635,0; 2 -0.635,0
SOT23-BEC = smd 1 x 1.4: B -0.95,-1.1; C 0,1.1; E 0.95,-1.1
2,54/0,8 = drill 0.813 pad 2.54 octagon: 1 0,0
DIL40 = drill 0.813 long: 1 -24.13,-7.62; 2 -21.59,-7.62; 3 -19.05,-7.62; 4 -16.51,-7.62; 5 -13.97,-7.62; 6 -11.43,-7.62; 7 -8.89,-7.62; 8 -6.35,-7.62; 9 -3.81,-7.62; 10 -1.27,-7.62; 11 1.27,-7.62; 12 3.81,-7.62; 13 6.35,-7.62; 14 8.89,-7.62; 15 11.43,-7.62; 16 13.97,-7.62; 17 16.51,-7.62; 18 19.05,-7.62; 19 21.59,-7.62; 20 24.13,-7.62; 21 24.13,7.62; 22 21.59,7.62; 23 19.05,7.62; 24 16.51,7.62; 25 13.97,7.62; 26 11.43,7.62; 27 8.89,7.62; 28 6.35,7.62; 29 3.81,7.62; 30 1.27,7.62; 31 -1.27,7.62; 32 -3.81,7.62; 33 -6.35,7.62; 34 -8.89,7.62; 35 -11.43,7.62; 36 -13.97,7.62; 37 -16.51,7.62; 38 -19.05,7.62; 39 -21.59,7.62; 40 -24.13,7.62

### Placement (x,y rotation side)
12V_A_ANT  4.06,35.18 270 top
12V_DAB_FM_CONVERTER  11.05,42.16 270 top
BLUETOOTH  49.15,42.16 90 top
C1  63.75,37.08 90 top
C2  44.7,41.53 0 bottom
C3  17.4,41.53 270 bottom
C5  9.14,32.64 270 bottom
C7  73.91,38.35 90 bottom
C27  40.89,12.95 180 bottom
C28  45.97,12.95 0 bottom
C29  33.27,15.11 180 bottom
C30  33.27,22.1 180 bottom
C32  21.21,14.22 90 bottom
C44  7.87,7.87 180 top
D1  70.1,12.32 90 top
D4  18.67,14.86 270 bottom
D5  21.21,33.91 180 bottom
D6  2.79,17.4 90 bottom
D8  14.22,14.86 270 bottom
D9  21.21,31.37 180 bottom
D10  12.32,37.08 0 top
D14  21.21,40.26 0 top
DAB_ANT  38.99,30.73 90 top
DAB_ANT_BAK  45.34,52.83 0 top  (outside the outline)
FM_ANT  38.99,36.45 90 top
H1  75.82,44.07 0 top
H2  3.43,44.07 0 top
H3  3.43,3.43 0 top
H4  75.82,3.43 0 top
I2C_EXPA  66.93,21.21 90 top
IC1  55.5,35.81 180 bottom
ICSP  4.7,11.68 270 top
KBRD  36.45,2.16 0 top
L1  65.02,40.26 0 top
L2  7.87,36.45 0 bottom
L3  38.35,27.33 0 bottom
L4  42.16,27.33 0 bottom
L5  14.86,41.53 270 bottom
LED1  68.83,37.08 0 top
LED2  71.37,40.26 0 top
LED3  9.14,36.45 0 top
LED4  75.18,14.86 0 top
LED6  43.43,33.91 0 top
LED7  18.03,41.53 180 top
MAIN_MCU_PWR  10.41,24.38 0 top
MCU_AMP  69.47,20.57 180 top
MKB_ICSP  65.66,44.07 0 top
MKB_UART  52.96,44.07 0 top
Q2  59.31,4.06 0 top
Q5  51.69,5.33 180 bottom
Q6  55.5,5.33 180 bottom
Q7  42.8,4.7 180 top
Q8  59.31,5.33 180 bottom
Q9  12.32,28.83 270 bottom
Q12  38.35,20.57 90 bottom
Q13  14.22,20.57 270 bottom
Q14  51.69,4.06 0 top
Q15  55.5,4.06 0 top
Q16  38.35,16.13 90 bottom
Q17  18.67,20.57 270 bottom
Q18  16.76,28.83 270 bottom
Q19  27.56,20.57 270 bottom
Q20  23.11,20.57 270 bottom
R1  52.32,21.21 90 bottom
R2  65.66,2.79 0 top
R3  28.19,32.64 180 top
R4  65.66,5.33 0 top
R5  44.07,32.64 0 bottom
R6  57.4,21.21 90 bottom
R7  59.94,21.21 90 bottom
R8  52.32,13.59 90 bottom
R9  49.15,21.21 270 bottom
R10  44.07,30.1 0 bottom
R11  61.21,12.57 0 bottom
R12  43.43,30.1 90 top
R13  21.21,42.8 180 top
R14  71.37,24.38 90 top
R15  72.64,10.41 270 top
R16  66.93,24.38 90 top
R17  61.85,37.08 90 top
R20  73.91,29.46 270 bottom
R21  49.15,16.76 90 bottom
R22  16.13,37.08 90 bottom
R23  75.18,10.41 90 top
R24  69.47,24.38 90 top
R25  65.66,7.87 0 top
R28  11.68,32.64 90 bottom
R29  16.13,32.64 90 bottom
R29-FAKE  73.28,24.38 90 top
R30  59.31,37.08 90 top
R31  52.32,37.72 270 top
R32  43.43,17.4 90 bottom
R33  52.32,33.27 270 top
R38  57.4,16.76 270 bottom
R39  59.94,16.76 270 bottom
R41  66.29,37.08 270 top
R43  11.68,14.22 270 bottom
R44  16.26,14.22 270 bottom
R60  71.37,36.45 90 top
R67  54.86,13.59 90 bottom
R68  54.86,21.21 270 bottom
R100  9.14,32.64 90 top
R101  11.68,32.64 90 top
SH1  5.33,30.1 270 bottom
T1  56.13,38.99 180 top
T2  56.13,34.54 180 top
TO_MKB_ANT_GND  36.45,44.07 0 top
TO_MKB_ANT_GND1  31.37,43.94 0 top
TO_MKB_ANT_GND2  31.37,38.86 0 top
TO_MKB_ANT_POS_1450_1475  33.91,41.4 0 top
U$2  35.81,17.4 0 top
VM3  77.72,40.77 90 top

### Tracks (layer width: path | path; a pad name or v marks a point on that pad's centre or on a via)
4052_A
  Bottom 0.406: U$2.22 R6.2
4052_B
  Bottom 0.406: R7.2 U$2.21
+5V  (via drill 0.7)
  Top 0.406: Q14.2 52.59,0.89 | Q2.2 60.21,1.79 59.31,0.89 56.4,0.89 | 56.4,0.89 52.59,0.89 | 52.59,0.89 49.15,0.89 | Q15.2 56.4,0.89 | 49.15,0.89 49.15,5.33 51.69,7.87 55.5,7.87 56.13,8.51 56.13,16.76 55.83,17.07 v54.86,17.07 54.86,17.08 v45.34,17.07 | 1.52,19.94 1.52,9.78 9.78,9.78 v9.78,5.33 9.78,0.89 49.15,0.89 | 60.58,28.83 60.58,30.1 61.85,31.37 61.85,33.91 63.12,35.18 63.75,35.18 C1.1 | 60.58,28.83 60.58,28.19 65.02,28.19 68.83,32 72.01,32 73.28,30.73 R29-FAKE.2 | 60.58,28.83 52.32,28.83 R33.2 52.01,32.64 50.95,32.64 | R31.2 51.05,35.5 IC1.16 50.95,32.64 | 50.95,32.64 v49.78,32.64
  Top 0.61: v2.79,21.21 1.52,19.94
  Bottom 0.406: R68.2 v54.86,17.07 R67.2 | 4.06,19.3 4.06,23.11 5.33,24.38 5.46,24.38 MAIN_MCU_PWR.P$2 | D6.A 4.06,19.3 | 16.13,18.03 17.29,18.03 D4.C | 16.13,18.03 9.78,18.03 9.14,18.67 4.06,18.67 4.06,19.3 | Q16.2 38.35,17.03 38.35,14.86 45.34,14.86 v45.34,17.07 45.34,22.48 45.97,23.11 45.97,26.29 49.78,30.1 v49.78,32.64 51.05,32.64 IC1.16 | C44.+ 9.78,7.87 v9.78,5.33 | R44.1 16.26,17.9 16.13,18.03
  Bottom 0.61: D6.A v2.79,21.21
+14V4  (via drill 0.7)
  Top 0.61: v0.89,31.37 0.89,29.46 14.22,29.46 | 14.22,29.46 19.3,29.46 | v19.3,28.83 19.3,29.46 | v35.18,37.72 35.18,29.46 | 35.18,29.46 v35.18,27.56 | 19.3,29.46 21.21,29.46 21.21,30.73 33.27,30.73 34.54,29.46 35.18,29.46 | v14.22,28.19 14.22,29.46
  Bottom 0.406: Q18.2 19.3,27.93 v19.3,28.83 | Q9.2 14.22,27.93 v14.22,28.19
  Bottom 0.61: MAIN_MCU_PWR.P$3 0.89,28.81 v0.89,31.37 | v35.18,27.56 35.18,28.83 R3.P$1 | R3.P$10 35.18,36.45 v35.18,37.72 | D9.C arc90 19.3,31.26 v19.3,28.83
  Bottom 0.813: D9.C D5.C
AGND
  Bottom 0.406: TO_MKB_ANT_GND.1 41.53,44.07 41.53,37.72 | 41.53,37.72 FM_ANT.1 | DAB_ANT.1 41.53,32 41.53,37.72
  Bottom 0.61: 31.37,45.34 6.6,45.34 5.33,44.07 5.33,40.89 | 31.37,45.34 35.18,45.34 TO_MKB_ANT_GND.1 | SH1.2 5.33,32 4.06,32 | TO_MKB_ANT_GND1.1 31.37,45.34 | TO_MKB_ANT_GND2.1 31.5,38.99 33.91,38.99 36.45,39.62 38.99,39.62 FM_ANT.1 | 5.33,40.89 4.7,40.89 1.52,37.72 1.52,33.27 2.79,32 4.06,32 | 12V_DAB_FM_CONVERTER.2 5.33,40.89 | 12V_A_ANT.2 4.06,32
  pour Bottom (isolate 0.406): -1.02,32 0.25,47.24 42.16,47.24 41.53,28.19 25.02,35.81 25.02,44.07 11.68,44.07 11.68,39.62 5.97,39.62 5.97,32
  pour Top (isolate 0.406): -1.02,32 -0.38,47.24 42.16,47.24 41.53,28.19 37.72,29.46 25.02,35.81 25.02,44.07 11.68,44.07 11.68,39.62 5.97,39.62 5.97,32
AMP_MODE
  Top 0.406: R16.1 R24.1 MCU_AMP.2
BT_3V3  (via drill 0.7)
  Top 0.305: 65.66,4.06 65.66,12.95
  Top 0.406: 65.66,12.95 65.02,12.95 63.75,14.22 63.75,19.3 60.58,22.48 59.31,22.48 58.67,23.11 58.67,26.29 56.77,28.19 53.59,28.19 52.32,26.92 47.24,26.92 45.97,28.19 45.97,37.08 45.34,37.72 | 65.66,4.06 67.56,4.06 68.83,5.33 68.83,8.51 70.1,9.78 D1.C 71.9,10.62 R15.1
  Top 0.61: 45.34,37.72 v44.07,37.72
  Bottom 0.406: 47,37.72 BLUETOOTH.P$2 | C2.1 45.65,37.72 45.34,37.72
  Bottom 0.61: v44.07,37.72 45.34,37.72 47,37.72
BT_4.8V_WARINIG
  Top 0.406: R23.1 R15.2 71.06,9.46 69.47,7.87 69.47,4.7 67.56,2.79 R2.2
BT_PWR_ON_OFF
  Bottom 0.406: R11.1 62.16,7.87 59.31,7.87 58.31,6.87 Q8.1
BT_RX
  Bottom 0.406: BLUETOOTH.P$3 49,37.08 52.32,37.08 IC1.2
BT_TX
  Bottom 0.406: IC1.15 52.32,34.8 48.72,34.8 BLUETOOTH.P$4
DAB_ANTEN_POWR_ON_OFF
  Bottom 0.406: U$2.30 38.35,25.02 38.35,20.57 37.35,19.57 Q12.1
DAB_FM_CONVERTER_POWR_ON_OFF
  Bottom 0.406: U$2.37 19.3,22.04 Q17.1
FM_ANTENA_POWR_ON_OFF
  Bottom 0.406: U$2.38 16.76,23.01 Q13.1
GND  (via drill 0.6, 0.7)  (4 unrouted)
  Top 0.305: T2.E 56.28,34.54 58.04,34.54 58.67,35.18 v58.67,40.89
  Top 0.406: R24.2 v69.47,27.56 | LED3.C@1 9.14,38.35 18.03,38.35 | D1.A 71.99,15.91 LED4.C | LED1.C 68.83,41.31 | 68.83,41.31 LED2.C | 68.83,41.31 65.88,41.31 64.39,42.8 MKB_ICSP.3 v64.39,45.97 | v65.02,31.37 65.02,37.72 64.07,37.72 C1.2 63.75,38.99 63.12,39.62 v61.85,39.62 R17.2 | T1.E 55.5,40.09 55.5,41.53 58.04,41.53 v58.67,40.89 | 18.03,38.35 20.57,38.35 21.21,38.99 v22.48,38.99 | LED7.C@1 18.03,38.35
  Top 0.61: LED4.C v75.18,17.4 | LED2.C 72.42,41.31 v72.64,40.89 | LED6.C@1 v43.43,35.81
  Bottom 0.305: IC1.8 59.94,39.62 v61.85,39.62 | 66.93,15.21 66.93,18.19 63.75,18.19
  Bottom 0.406: R38.2 R39.2 62.17,15.81 63.75,17.4 63.75,18.19 | IC1.6 57.4,39.62 58.67,39.62 | 58.67,39.62 59.94,39.62 | IC1.7 58.67,39.62 | 66.93,18.19 66.93,30.73 | 66.93,30.73 69.47,30.73 | 69.47,30.73 72.64,30.73 72.64,28.51 R20.2 73.91,27.88 74.55,27.24 77.47,27.24 77.47,38.26 VM3.P$1 75.49,39.3 C7.2 73.91,39.53 | Q5.2 53.64,5.38 | 53.64,5.38 53.69,5.33 56.4,5.33 | 56.4,5.33 60.21,5.33 | Q8.2 60.21,5.33 | Q6.2 56.4,5.33 | 76.45,17.4 76.45,8.19 68.69,8.19 66.93,6.43 | R10.2 R5.2 43.12,35.81 | C30.2 34.54,22.42 U$2.31 34.54,26.29 33.27,27.56 29.46,27.56 28.19,26.29 28.19,23.75 28.83,23.11 29.46,23.11 30.1,22.48 30.1,19.94 29.83,19.67 Q19.2 Q20.2 21.21,19.67 | 66.93,6.43 66.93,15.21 I2C_EXPA.P$3 | 53.64,5.38 53.64,12.64 R8.1 arc90 52.01,12.95 49.15,12.95 | 0.89,17.68 0.89,7.87 C44.- 6.6,6.6 7.24,5.97 7.24,4.7 8.51,3.43 8.51,0.89 35.81,0.89 38.35,3.43 38.35,4.7 39.62,5.97 U$2.12 39.62,11.05 38.99,11.05 37.08,12.95 | ICSP.P$3 0.89,17.68 | MAIN_MCU_PWR.P$1 7.96,27.47 6.92,28.51 | 6.92,28.51 6.6,28.83 5.33,28.83 | 5.33,28.83 4.7,28.83 4.06,28.19 4.06,24.38 2.79,23.11 0.89,23.11 0.89,17.68 | Q13.2 Q17.2 21.21,19.67 | 37.08,12.95 34.54,12.95 34.22,13.27 C29.2 C30.2 | 37.08,12.95 C27.1 39.94,14.22 46.92,14.22 C28.1 49.15,12.95 | Q12.2 35.99,22.1 C30.2 | v69.47,27.56 69.47,30.73 | SH1.1 5.33,28.83 | C5.2 6.92,28.51 | v43.43,35.81 42.8,35.81 42.8,41.53 | C2.2 42.8,41.53 | 42.8,41.53 42.8,43.43 47.45,43.43 | 47.45,43.43 v47.88,43.43 47.88,45.97 v64.39,45.97 | BLUETOOTH.P$1 47.45,43.43 | R21.1 49.15,12.95 | 60.21,5.33 65.83,5.33 66.93,6.43 | v65.02,31.37 66.29,31.37 66.93,30.73 | v58.67,40.89 58.67,39.62 | v22.48,38.99 D14.A 22.48,41.53 18.67,41.53 17.72,40.58 C3.2
  Bottom 0.406: C32.2 21.21,19.67
  Bottom 0.61: 76.45,17.4 v75.18,17.4 | v72.64,40.89 C7.2 | 43.12,35.81 v43.43,35.81
  pour Bottom (isolate 0.406): -0.38,-0.38 -1.02,30.73 6.6,30.73 7.24,43.43 24.38,43.43 24.38,33.91 33.27,30.73 37.08,27.56 42.16,27.56 42.16,47.24 78.99,46.61 78.36,-0.38
  pour Top (isolate 0.406): -1.02,30.73 6.6,30.73 6.6,38.99 11.68,38.99 12.32,43.43 24.38,43.43 24.38,34.54 32,31.37 37.08,27.56 42.16,27.56 42.16,47.24 78.99,46.61 78.36,-0.38 -1.65,-1.65
ICSP_MCLR
  Bottom 0.406: ICSP.P$1 7.78,13.68 U$2.1
  Bottom 0.61: U$2.1 R43.2
ICSP_PGC
  Bottom 0.406: U$2.39 12.32,23.11 7.24,23.11 6.4,22.27 ICSP.P$5
ICSP_PGD
  Bottom 0.406: ICSP.P$4 5.59,19.68 4.7,20.57 4.7,22.48 5.97,23.75 10.41,23.75 U$2.40
ICSP_VCC
  Bottom 0.406: U$2.32 32,22.42 C30.1 | C30.1 32.64,21.78 | ICSP.P$2 2.98,15.68 D6.C 2.16,14.86 1.52,14.22 1.52,9.78 7.87,9.78 7.87,6.6 8.51,5.97 8.51,4.7 9.78,3.43 9.78,1.52 35.18,1.52 37.08,3.43 U$2.11 37.08,11.68 36.45,12.32 33.91,12.32 32.32,13.9 C29.1 C30.1
KBRD_BUT1  (via drill 0.7)
  Top 0.406: v34.54,7.87 14.86,7.87 v11.68,4.06
  Bottom 0.406: v34.54,7.87 U$2.10 | 16.13,5.33 13.59,5.33 12.32,4.7
  Bottom 0.61: 12.32,4.7 v11.68,4.06
  Bottom 0.813: KBRD.P$10 16.13,4.18 16.13,5.33
KBRD_BUT2
  Bottom 0.406: U$2.6 26.45,7.71
  Bottom 0.61: 26.45,7.71 KBRD.P$5
KBRD_BUT3
  Bottom 0.406: U$2.7 28.45,8.25
  Bottom 0.61: 28.45,8.25 KBRD.P$4
KBRD_BUT4
  Bottom 0.406: 30.45,8.79 U$2.8
  Bottom 0.61: KBRD.P$3 30.45,8.79
KBRD_BUT5
  Bottom 0.61: 32,4.3 U$2.9
  Bottom 0.813: KBRD.P$2 32,4.3
KBRD_EQU_BUT  (via drill 0.7)
  Top 0.406: v49.15,7.24 48.51,7.87 38.35,7.87 37.08,6.6 14.86,6.6 12.95,4.06
  Top 0.61: 12.95,4.06 12.95,2.67 v11.68,2.67
  Bottom 0.406: v49.15,7.24 47.24,9.14 U$2.15 | v11.68,2.67 14.45,2.67 KBRD.P$11
KBRD_EQU_DOWN
  Bottom 0.406: U$2.4 22.45,6.63
  Bottom 0.61: 22.45,6.63 KBRD.P$7
KBRD_EQU_UP
  Bottom 0.406: U$2.5 24.45,7.17
  Bottom 0.61: 24.45,7.17 KBRD.P$6
KBRD_INT
  Bottom 0.406: 34.54,5.33 35.81,6.6 35.81,11.05 35.18,11.68 32.64,11.68 30.73,13.59 30.73,23.75 U$2.33
  Bottom 0.61: 34.54,3.95 34.54,5.33
  Bottom 0.813: KBRD.P$1 34.54,3.95
KBRD_VOL_DOWN
  Bottom 0.406: U$2.2 18.45,5.55
  Bottom 0.813: 18.45,5.55 KBRD.P$9
KBRD_VOL_UP
  Bottom 0.406: U$2.3 20.45,6.09
  Bottom 0.61: 20.45,6.09 KBRD.P$8
MKB_4.8V  (via drill 0.7)
  Top 0.406: v68.2,17.4 72.01,17.4 73.91,19.3 73.91,21.21 74.55,21.84 74.55,26.29 73.91,26.92 73.91,31.37 72.64,32.64 71.37,32.64 70.1,33.91 70.1,37.08 67.56,37.08 67.56,38.03 R41.1 66.29,39.69 L1.2 | v68.2,12.32 68.2,5.97 67.56,5.33 R4.2
  Bottom 0.406: v68.2,17.4 v68.2,12.32
MKB_PIC_PGD_PIN
  Bottom 0.406: R1.2 U$2.24
MKB_PIC_PGD_PIN_  (via drill 0.7)
  Top 0.406: v61.85,29.46 65.02,29.46 66.93,31.37 v66.93,34.54
  Bottom 0.406: R8.2 R1.1 53.59,20.26 53.59,25.65 52.96,26.92 52.96,28.19 53.59,28.83 61.21,28.83 v61.85,29.46 | v66.93,34.54 MKB_ICSP.4
MKB_PWR_ON_OFF
  Bottom 0.406: U$2.19 55.5,7.87 55.5,7.43 Q6.1
MKB_RX  (via drill 0.7)
  Top 0.406: MKB_UART.2 v52.96,42.16
  Bottom 0.406: v52.96,42.16 54.86,42.16 56.13,40.89 IC1.5
MKB_TX  (via drill 0.7)
  Top 0.406: v49.78,35.81 49.78,43.43
  Top 0.813: 49.78,43.43 MKB_UART.1
  Bottom 0.406: IC1.14 53.59,35.81 v49.78,35.81
N$1  (via drill 0.7)
  Top 0.406: R12.1 43.43,27.56 v44.7,27.56
  Bottom 0.406: R32.2 43.43,27.33 L4.1 43.16,27.56 v44.7,27.56
N$2
  Bottom 0.406: Q19.3 26.46,21.04 25.02,22.48 24.38,22.48 23.11,23.75 R3.P$5 23.22,28.93 D9.A
N$3
  Bottom 0.61: 33.27,41.4 29.97,41.4 28.19,39.62 R3.P$8
  Bottom 0.813: TO_MKB_ANT_POS_1450_1475.1 33.27,41.4 33.15,41.4
N$4
  Bottom 0.61: R3.P$7 28.19,33.91 30.46,33.91 37.08,29.46 | L3.2 37.08,27.83 37.08,29.46 | DAB_ANT.2 37.08,29.46
N$5
  Bottom 0.61: R3.P$9 32.64,34.54 38.35,34.54 FM_ANT.2
N$6
  Bottom 0.406: D5.A 23.11,34.01 R3.P$6 21.84,36.45 21.21,35.81 21.21,28.83 20.57,28.19 20.57,22.7 Q20.3
N$7
  Top 0.406: Q2.3 59.43,5.33 61.21,5.33 63.75,2.79 R2.1
N$8  (via drill 0.7)
  Top 0.406: R16.2 65.34,25.33 64.39,24.38 64.39,23.75 v63.75,23.11 | v56.13,26.67 56.13,23.11 54.86,21.84 41.53,21.84 v40.89,21.21
  Bottom 0.406: v63.75,23.11 63.12,23.11 63.12,25.65 61.21,27.56 57.4,27.56 v56.13,26.67 | v40.89,21.21 39.62,23.75 U$2.29
N$9  (via drill 0.7)
  Top 0.406: v59.31,29.77 59.31,30.1 61.21,32 61.21,35.5 R17.1
  Bottom 0.406: IC1.12 56.13,31.37 56.77,30.73 58.04,30.73 v59.31,29.77
N$10  (via drill 0.6, 0.7)
  Top 0.406: v64.39,26.29 69.47,31.37 71.37,31.37 72.64,30.1 72.64,27.56 71.37,26.29 R14.2 | v54.23,27.18 53.59,26.29 53.59,23.11 52.96,22.48 26.92,22.48 25.65,23.75 v25.65,27.18
  Bottom 0.406: v64.39,26.29 62.48,28.19 55.5,28.19 v54.23,27.18 | v25.65,27.18 25.65,25.02 U$2.34
N$11
  Top 0.406: R30.2 58.99,38.35 58.04,38.35 57.08,39.31 T1.B
N$12
  Bottom 0.406: L4.2 L3.1
N$13
  Bottom 0.406: R39.1 R7.1 60.26,20.57 61.21,20.57 61.85,21.21 65.02,21.21 66.29,22.48 66.29,27.56 63.75,30.1 63.75,30.73 63.12,31.37 59.94,31.37 IC1.9
N$14
  Top 0.406: T2.B 57.08,36.94 T1.C 55.35,38.67 R31.1
N$15
  Bottom 0.406: Q7.2 42.16,6.48 U$2.13 arc-90 41.84,10.1 C27.2
N$16
  Bottom 0.406: Q7.1 44.7,5.21 U$2.14 44.7,12.63 arc-90 C28.2
N$17
  Bottom 0.406: U$2.20 59.94,12.57 R11.2
N$18
  Top 0.406: Q15.3 55.62,5.33 56.13,5.33 58.04,7.24 62.8,7.24 R4.1
N$19  (via drill 0.7)
  Top 0.406: 58.29,2.95 Q2.1
  Top 0.813: v58.29,2.16 58.29,2.95
  Bottom 0.406: 58.29,3.27 Q8.3
  Bottom 0.813: v58.29,2.16 58.29,3.27
N$20
  Bottom 0.406: Q12.3 39.62,20.52 39.62,19.3 38.35,18.67 35.81,18.67 35.81,15.49 36.18,15.13 Q16.1
N$21
  Top 0.406: R23.2 LED4.A
N$23
  Top 0.406: R12.2 LED6.A@1
N$25
  Bottom 0.406: Q17.3 18.03,20.62 18.03,26.29 17.4,26.92 16.76,26.92 16.76,29.83 Q18.1
N$26  (via drill 0.7)
  Top 0.406: v19.94,36.45 21.21,37.72 23.11,37.72 23.75,38.35 23.75,41.53 22.48,42.8 R13.1
  Bottom 0.406: R29.2 R22.1 16.13,36.45 v19.94,36.45
N$27
  Top 0.406: LED7.A@1 18.8,42.8 R13.2
N$28  (via drill 0.7)
  Top 0.813: Q14.1 v50.67,2.16
  Bottom 0.406: 50.67,3.27 Q5.3
  Bottom 0.813: v50.67,2.16 50.67,3.27
N$29
  Bottom 0.406: L5.1 16.13,42.48 | 16.13,42.48 C3.1 | 16.13,42.48 R22.2 18.35,38.03 19.94,39.62 D14.C
N$30
  Bottom 0.406: 12V_DAB_FM_CONVERTER.1 11.68,43.43 14.54,40.58 L5.2
N$31
  Top 0.406: R60.2 LED2.A
N$32
  Top 0.406: Q14.3 53.08,6.6 56.13,6.6 57.4,7.87 R25.1
N$33
  Bottom 0.406: Q16.3 39.82,16.45 R32.1
N$34
  Bottom 0.406: Q9.3 11.22,31.22 R28.1
N$35
  Bottom 0.406: Q18.3 15.66,31.22 R29.1
N$37  (via drill 0.7)
  Top 0.406: v54.48,2.16 54.5,2.17
  Top 0.813: 54.5,2.17 Q15.1
  Bottom 0.406: Q6.3 54.48,3.27
  Bottom 0.813: 54.48,3.27 v54.48,2.16
N$38
  Bottom 0.406: BLUETOOTH.P$5 46.97,32.64 R5.1
N$39
  Top 0.406: LED1.A 66.39,36.03 R41.2
N$41
  Bottom 0.406: R43.1 13.27,16.76 D8.C
N$42
  Bottom 0.61: D8.A 17.4,12.96 | 17.4,12.96 18.67,12.96 | 18.67,12.96 21.53,12.96 arc90 C32.1 | D4.A 18.77,13.06 arc90 18.67,12.96 | R44.2 17.08,13.27 arc-90 17.4,12.96
N$43
  Bottom 0.406: BLUETOOTH.P$6 44.07,30.1 R10.1
N$44
  Bottom 0.406: VM3.P$6 74.69,30.1 74.55,30.1 74.23,30.41 R20.1
N$47
  Bottom 0.406: R38.1 R6.1 58.67,20.26 58.67,26.29 59.31,26.92 60.58,26.92 61.85,25.65 61.85,22.48 62.48,21.84 64.39,21.84 65.66,23.11 65.66,26.92 63.12,29.46 63.12,30.1 62.48,30.73 59.31,30.73 58.67,31.37 IC1.10
N$85
  Bottom 0.406: Q13.3 13.12,21.38 15.49,23.75 15.49,26.29 14.86,26.92 12.32,26.92 12.32,29.83 Q9.1
N$87  (via drill 0.7)
  Top 0.406: 8.51,31.37 8.82,31.37 R100.1 R101.1 12.95,31.69 v12.95,35.18
  Bottom 0.406: v12.95,35.18 12.95,33.59 R28.2
N$88
  Top 0.406: R100.2 LED3.A@1
N$91  (via drill 0.7)
  Top 0.406: R101.2 11.05,34.22 v11.05,35.18
  Bottom 0.406: C5.1 9.14,36.45 | 9.14,36.45 L2.1 | v11.05,35.18 11.05,36.45 | 11.05,36.45 D10.C | 9.14,36.45 11.05,36.45
N$92
  Bottom 0.406: 12V_A_ANT.1 L2.2
PIC_RX_HV  (via drill 0.7)
  Top 0.406: R33.1 53.91,34.22 54.86,33.27 55.96,33.27 T2.C 56.13,32.64 54.86,31.37 54.23,31.37 53.59,30.73 v53.59,30.35
  Bottom 0.406: U$2.26 52.58,30.35 v53.59,30.35
PIC_TX_HV
  Bottom 0.406: U$2.25 49.15,24.38 R9.1
RX_LV  (via drill 0.7)
  Top 0.406: R30.1 59.31,32.64 57.4,30.73 55.88,30.73 v55.5,30.35
  Bottom 0.406: IC1.13 54.86,31.37 v55.5,30.35
SCL
  Bottom 0.406: U$2.18 R67.1 57.4,12.62 59,14.22 62.48,14.22 I2C_EXPA.P$2
SDA
  Bottom 0.305: 61.34,16.76 56.13,16.76
  Bottom 0.406: U$2.23 R68.1 56.13,22.16 56.13,16.76 | 61.34,16.76 61.34,17.53 63.02,19.21 I2C_EXPA.P$1
SWITCH_2_DAB_ANT
  Bottom 0.406: Q19.1 27.12,23.11 25.65,23.11 24.38,24.38 U$2.35
SWITCH_2_FM_ANT
  Bottom 0.406: Q20.1 23.38,21.57 21.84,23.11 U$2.36
TO_MKB_VCC
  Top 0.406: L1.1 61.85,42.53 MKB_ICSP.2
TX_LV  (via drill 0.7)
  Top 0.406: v51.69,40.89 53.59,40.89 54.86,42.16 59.31,42.16 60.58,40.89 60.58,32.64 59.94,32 59.64,32 v57.4,29.77
  Bottom 0.406: v51.69,40.89 53.59,40.89 IC1.3 | v57.4,29.77 57.1,29.46 52.96,29.46 51.05,27.56 51.05,21.21 50.42,20.57 49.46,20.57 arc90 R9.2 R21.2
VDIAG
  Top 0.406: R29-FAKE.1 72.01,23.43 | 72.01,23.43 R14.1 | MCU_AMP.1 72.01,23.43
VM3_4.8V  (via drill 0.7)
  Top 0.406: R25.2 66.61,13.27 70.1,16.76 72.64,16.76 74.55,18.67 74.55,20.57 75.18,21.21 75.18,26.92 74.55,27.56 74.55,33.91 | R60.1 71.37,34.86
  Top 0.61: 74.55,33.91 v72.01,33.91 71.37,34.86
  Bottom 0.406: 74.4,33.91 74.52,33.97 74.52,34.77 | 73.91,33.91 73.28,33.91 | C7.1 74.52,36.8 74.52,35.18 74.52,34.77 | VM3.P$3 74.52,34.77
  Bottom 0.61: v72.01,33.91 73.28,33.91 74.4,33.91
VM3_PWR_ON_OFF
  Bottom 0.406: U$2.17 52.32,8.07 Q5.1
VM3_RX
  Bottom 0.406: VM3.P$4 75.39,32.89 69.21,32.89 68.83,33.27 65.02,33.27 61.85,36.45 55.5,36.45 54.86,37.08 IC1.4
VM3_TX
  Bottom 0.406: VM3.P$5 74.39,32.16 68.67,32.16 68.2,32.64 64.39,32.64 61.21,35.81 57.4,35.81 IC1.11